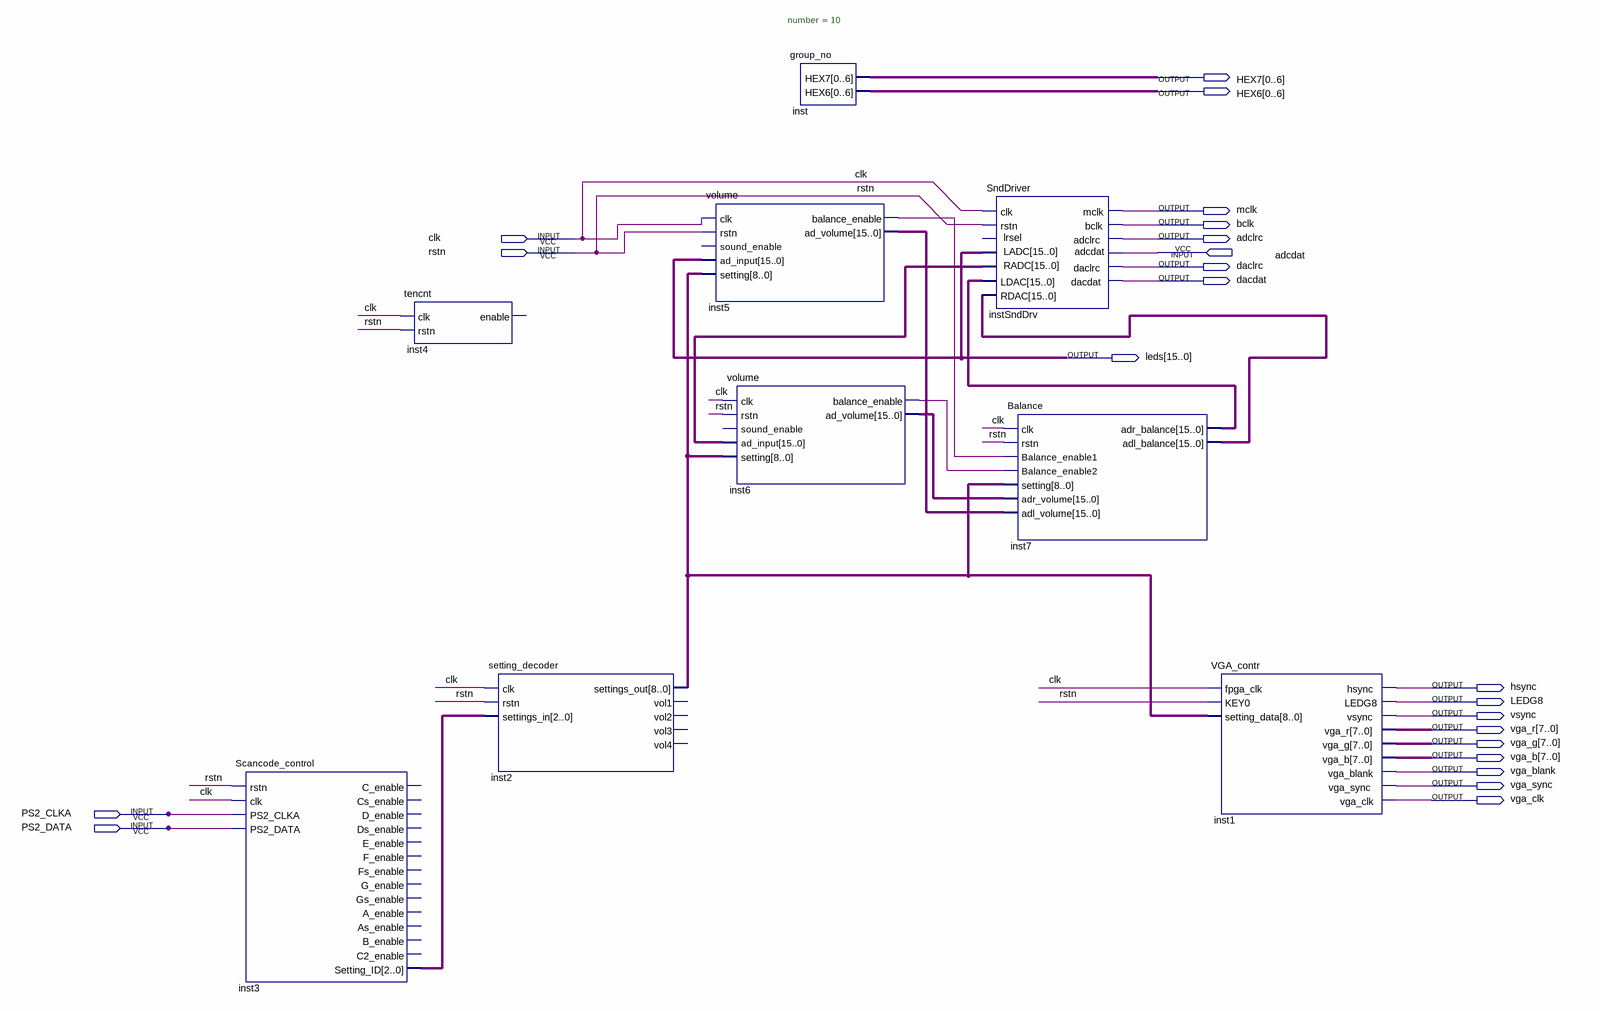
[diagram p0: schematic sheet]
// Quartus schematic Sound.bdf as structural Verilog: 9 symbols, 22 pins
module Sound (
  input  clk,
  input  rstn,
  input  adcdat,
  input  PS2_CLKA,
  input  PS2_DATA,
  output [0:6] HEX7,
  output [0:6] HEX6,
  output mclk,
  output bclk,
  output adclrc,
  output daclrc,
  output dacdat,
  output [15:0] leds,
  output hsync,
  output LEDG8,
  output vsync,
  output [7:0] vga_r,
  output [7:0] vga_g,
  output [7:0] vga_b,
  output vga_blank,
  output vga_sync,
  output vga_clk
);

  wire inst5_balance_enable, inst6_balance_enable;
  wire [2:0] inst3_setting_id;
  wire [8:0] inst2_settings_out;
  wire [15:0] inst5_ad_volume, inst6_ad_volume, inst7_adl_balance, inst7_adr_balance, instSndDrv_radc;

  Scancode_control inst3 (
    .rstn(rstn), .clk(clk), .PS2_CLKA(PS2_CLKA), .PS2_DATA(PS2_DATA), .Setting_ID(inst3_setting_id));  // open: C_enable, Cs_enable, D_enable, Ds_enable, E_enable, F_enable, Fs_enable, G_enable, Gs_enable, A_enable, As_enable, B_enable, C2_enable
  tencnt inst4 (.clk(clk), .rstn(rstn));  // open: enable
  setting_decoder inst2 (
    .clk(clk), .rstn(rstn), .settings_in(inst3_setting_id), .settings_out(inst2_settings_out));  // open: vol1, vol2, vol3, vol4
  volume inst5 (
    .clk(clk), .rstn(rstn), .ad_input(leds), .setting(inst2_settings_out),
    .balance_enable(inst5_balance_enable), .ad_volume(inst5_ad_volume));  // open: sound_enable
  volume inst6 (
    .clk(clk), .rstn(rstn), .ad_input(instSndDrv_radc), .setting(inst2_settings_out),
    .balance_enable(inst6_balance_enable), .ad_volume(inst6_ad_volume));  // open: sound_enable
  group_no #(.number(10)) inst (.HEX7(HEX7), .HEX6(HEX6));
  SndDriver instSndDrv (
    .clk(clk), .rstn(rstn), .LDAC(inst7_adr_balance), .adcdat(adcdat), .RDAC(inst7_adl_balance), .mclk(mclk),
    .bclk(bclk), .adclrc(adclrc), .daclrc(daclrc), .LADC(leds), .dacdat(dacdat), .RADC(instSndDrv_radc));  // open: lrsel
  Balance inst7 (
    .clk(clk), .rstn(rstn), .Balance_enable1(inst5_balance_enable), .Balance_enable2(inst6_balance_enable),
    .setting(inst2_settings_out), .adr_volume(inst6_ad_volume), .adl_volume(inst5_ad_volume),
    .adr_balance(inst7_adr_balance), .adl_balance(inst7_adl_balance));
  VGA_contr inst1 (
    .fpga_clk(clk), .KEY0(rstn), .setting_data(inst2_settings_out), .hsync(hsync), .LEDG8(LEDG8),
    .vsync(vsync), .vga_r(vga_r), .vga_g(vga_g), .vga_b(vga_b), .vga_blank(vga_blank), .vga_sync(vga_sync),
    .vga_clk(vga_clk));
endmodule
